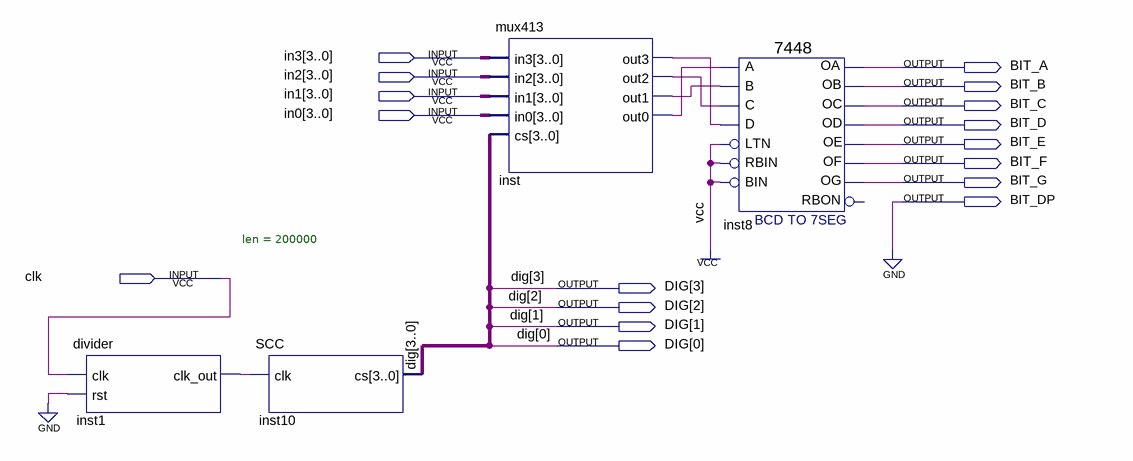
[diagram p0: schematic sheet]
// Quartus schematic SD.bdf as structural Verilog: 4 symbols, 17 pins
module SD (
  input  [3:0] in3,
  input  [3:0] in2,
  input  [3:0] in1,
  input  [3:0] in0,
  input  clk,
  output BIT_A,
  output BIT_B,
  output BIT_C,
  output BIT_D,
  output BIT_E,
  output BIT_F,
  output BIT_G,
  output BIT_DP,
  output [3:0] DIG
);

  wire inst1_clk_out, inst_out0, inst_out1, inst_out2, inst_out3;

  divider #(.len(200000)) inst1 (.clk(clk), .rst(1'b0), .clk_out(inst1_clk_out));
  SCC inst10 (.clk(inst1_clk_out), .cs(DIG));
  mux413 inst (
    .in3(in3), .in2(in2), .in1(in1), .in0(in0), .cs(DIG), .out3(inst_out3), .out2(inst_out2),
    .out1(inst_out1), .out0(inst_out0));
  \7448  inst8 (
    .A(inst_out0), .C(inst_out2), .D(inst_out3), .B(inst_out1), .RBIN(1'b1), .BIN(1'b1), .LTN(1'b1),
    .OC(BIT_C), .OE(BIT_E), .OD(BIT_D), .OF(BIT_F), .OG(BIT_G), .OB(BIT_B), .OA(BIT_A));  // open: RBON

  assign BIT_DP = 1'b0;
endmodule
